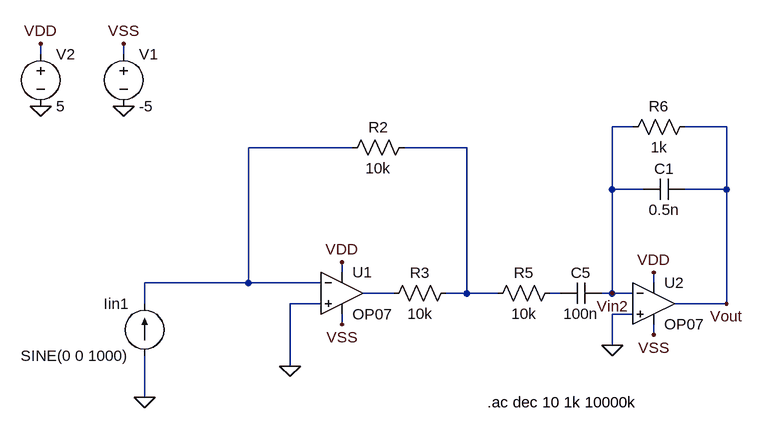
[diagram p0: schematic TIA-MinimalZ-BP-1.asc]
TIA-MinimalZ-BP-1.asc, the LTspice schematic file:
Version 4
SHEET 1 904 680
WIRE -192 96 -192 80
WIRE -64 96 -64 80
WIRE 720 208 688 208
WIRE 864 208 800 208
WIRE 288 240 128 240
WIRE 464 240 368 240
WIRE 688 304 688 208
WIRE 736 304 688 304
WIRE 864 304 864 208
WIRE 864 304 800 304
WIRE 272 432 272 416
WIRE 128 448 128 240
WIRE 128 448 -32 448
WIRE 240 448 128 448
WIRE 752 448 752 432
WIRE 352 464 304 464
WIRE 464 464 464 240
WIRE 464 464 432 464
WIRE 512 464 464 464
WIRE 608 464 592 464
WIRE 688 464 688 304
WIRE 688 464 672 464
WIRE 720 464 688 464
WIRE -32 480 -32 448
WIRE 240 480 192 480
WIRE 864 480 864 304
WIRE 864 480 784 480
WIRE 720 496 688 496
WIRE 272 512 272 496
WIRE 752 528 752 512
WIRE 688 544 688 496
WIRE 192 576 192 480
WIRE -32 624 -32 560
FLAG -64 176 0
FLAG -192 176 0
FLAG -192 80 VDD
FLAG -64 80 VSS
FLAG 272 416 VDD
FLAG 272 512 VSS
FLAG -32 624 0
FLAG 192 576 0
FLAG 752 432 VDD
FLAG 752 528 VSS
FLAG 688 544 0
FLAG 864 480 Vout
FLAG 688 464 Vin2
SYMBOL OP07 272 400 R0
SYMATTR InstName U1
SYMBOL voltage -64 80 R0
SYMATTR InstName V1
SYMATTR Value -5
SYMBOL voltage -192 80 R0
SYMATTR InstName V2
SYMATTR Value 5
SYMBOL current -32 560 R180
WINDOW 0 24 80 Left 2
WINDOW 3 24 0 Left 2
SYMATTR InstName Iin1
SYMATTR Value SINE(0 0 1000)
SYMATTR Value2 AC 1
SYMBOL Res 384 224 R90
WINDOW 0 0 56 VBottom 2
WINDOW 3 32 56 VTop 2
SYMATTR InstName R2
SYMATTR Value 10k
SYMBOL Res 448 448 R90
WINDOW 0 0 56 VBottom 2
WINDOW 3 32 56 VTop 2
SYMATTR InstName R3
SYMATTR Value 10k
SYMBOL Res 608 448 R90
WINDOW 0 0 56 VBottom 2
WINDOW 3 32 56 VTop 2
SYMATTR InstName R5
SYMATTR Value 10k
SYMBOL Cap 672 448 R90
WINDOW 0 0 32 VBottom 2
WINDOW 3 32 32 VTop 2
SYMATTR InstName C5
SYMATTR Value 100n
SYMBOL OP07 752 416 R0
SYMATTR InstName U2
SYMBOL Res 816 192 R90
WINDOW 0 0 56 VBottom 2
WINDOW 3 32 56 VTop 2
SYMATTR InstName R6
SYMATTR Value 1k
SYMBOL Cap 800 288 R90
WINDOW 0 0 32 VBottom 2
WINDOW 3 32 32 VTop 2
SYMATTR InstName C1
SYMATTR Value 0.5n
TEXT 496 632 Left 2 !.ac dec 10 1k 10000k

The netlist it stands for:
* TIA-MinimalZ-BP-1.asc
XU1 0 N001 VDD VSS N003 LT1001  ; OP07, pins In+ In- V+ V- OUT
V1 VSS 0 -5
V2 VDD 0 5
Iin1 0 N001 SINE(0 0 1000) AC 1
R2 N002 N001 10k
R3 N002 N003 10k
R5 N004 N002 10k
C5 Vin2 N004 100n
XU2 0 Vin2 VDD VSS Vout LT1001  ; OP07, pins In+ In- V+ V- OUT
R6 Vout Vin2 1k
C1 Vout Vin2 0.5n
.ac dec 10 1k 10000k
.lib LTC.lib
.backanno
.end